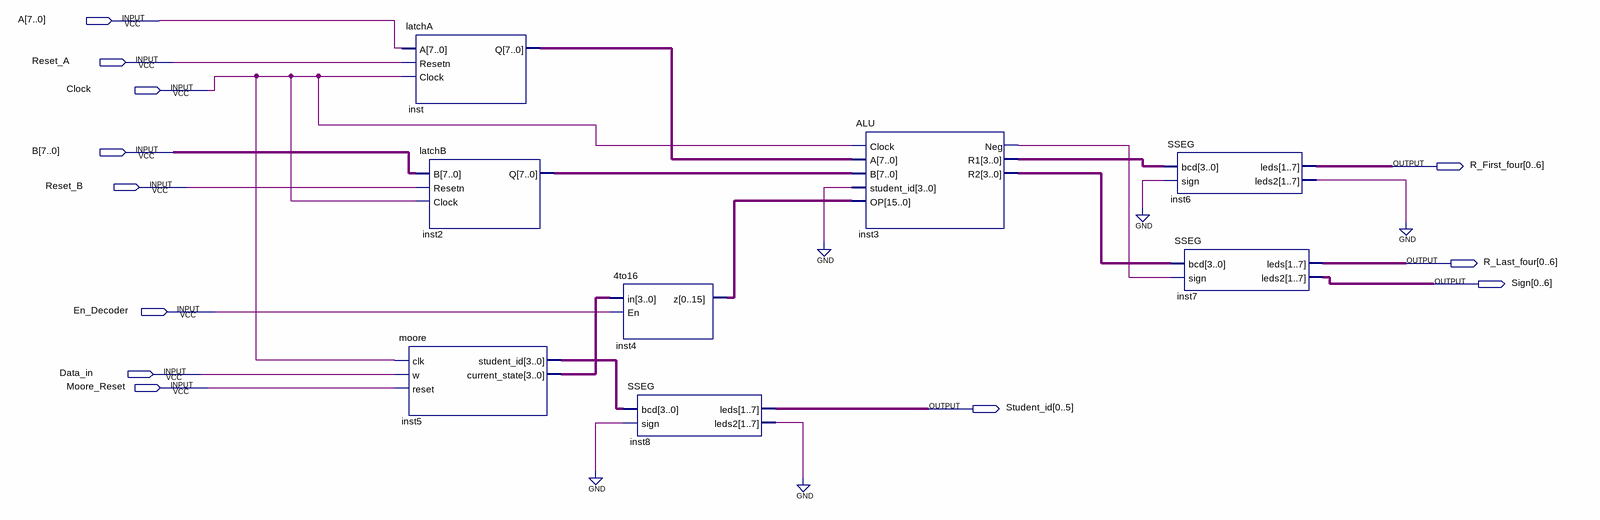
[diagram p0: schematic sheet]
// Quartus schematic lab6.bdf as structural Verilog: 8 symbols, 12 pins
module lab6 (
  input  [7:0] A,
  input  Reset_A,
  input  Clock,
  input  [7:0] B,
  input  Reset_B,
  input  En_Decoder,
  input  Data_in,
  input  Moore_Reset,
  output [0:6] R_First_four,
  output [0:6] R_Last_four,
  output [0:6] Sign,
  output [0:5] Student_id
);

  wire inst3_neg, inst6_leds2, inst8_leds2;
  wire [3:0] inst3_r1, inst3_r2, inst5_current_state, inst5_student_id;
  wire [7:0] inst2_q, inst_q;
  wire [15:0] inst4_z;

  moore inst5 (
    .clk(Clock), .w(Data_in), .reset(Moore_Reset), .student_id(inst5_student_id),
    .current_state(inst5_current_state));
  latchA inst (.A(A), .Resetn(Reset_A), .Clock(Clock), .Q(inst_q));
  latchB inst2 (.B(B), .Resetn(Reset_B), .Clock(Clock), .Q(inst2_q));
  \4to16  inst4 (.in(inst5_current_state), .En(En_Decoder), .z(inst4_z));
  SSEG inst8 (.bcd(inst5_student_id), .sign(1'b0), .leds(Student_id), .leds2(inst8_leds2));
  ALU inst3 (
    .Clock(Clock), .A(inst_q), .B(inst2_q), .student_id(4'b0000), .OP(inst4_z), .Neg(inst3_neg),
    .R1(inst3_r1), .R2(inst3_r2));
  SSEG inst6 (.bcd(inst3_r1), .sign(1'b0), .leds(R_First_four), .leds2(inst6_leds2));
  SSEG inst7 (.bcd(inst3_r2), .sign(inst3_neg), .leds(R_Last_four), .leds2(Sign));
  // also tied to GND on the sheet: {inst6_leds2, inst8_leds2}
endmodule
